# Altium schematic sheet Inv_filter_v1_SCH.SchDoc
size D
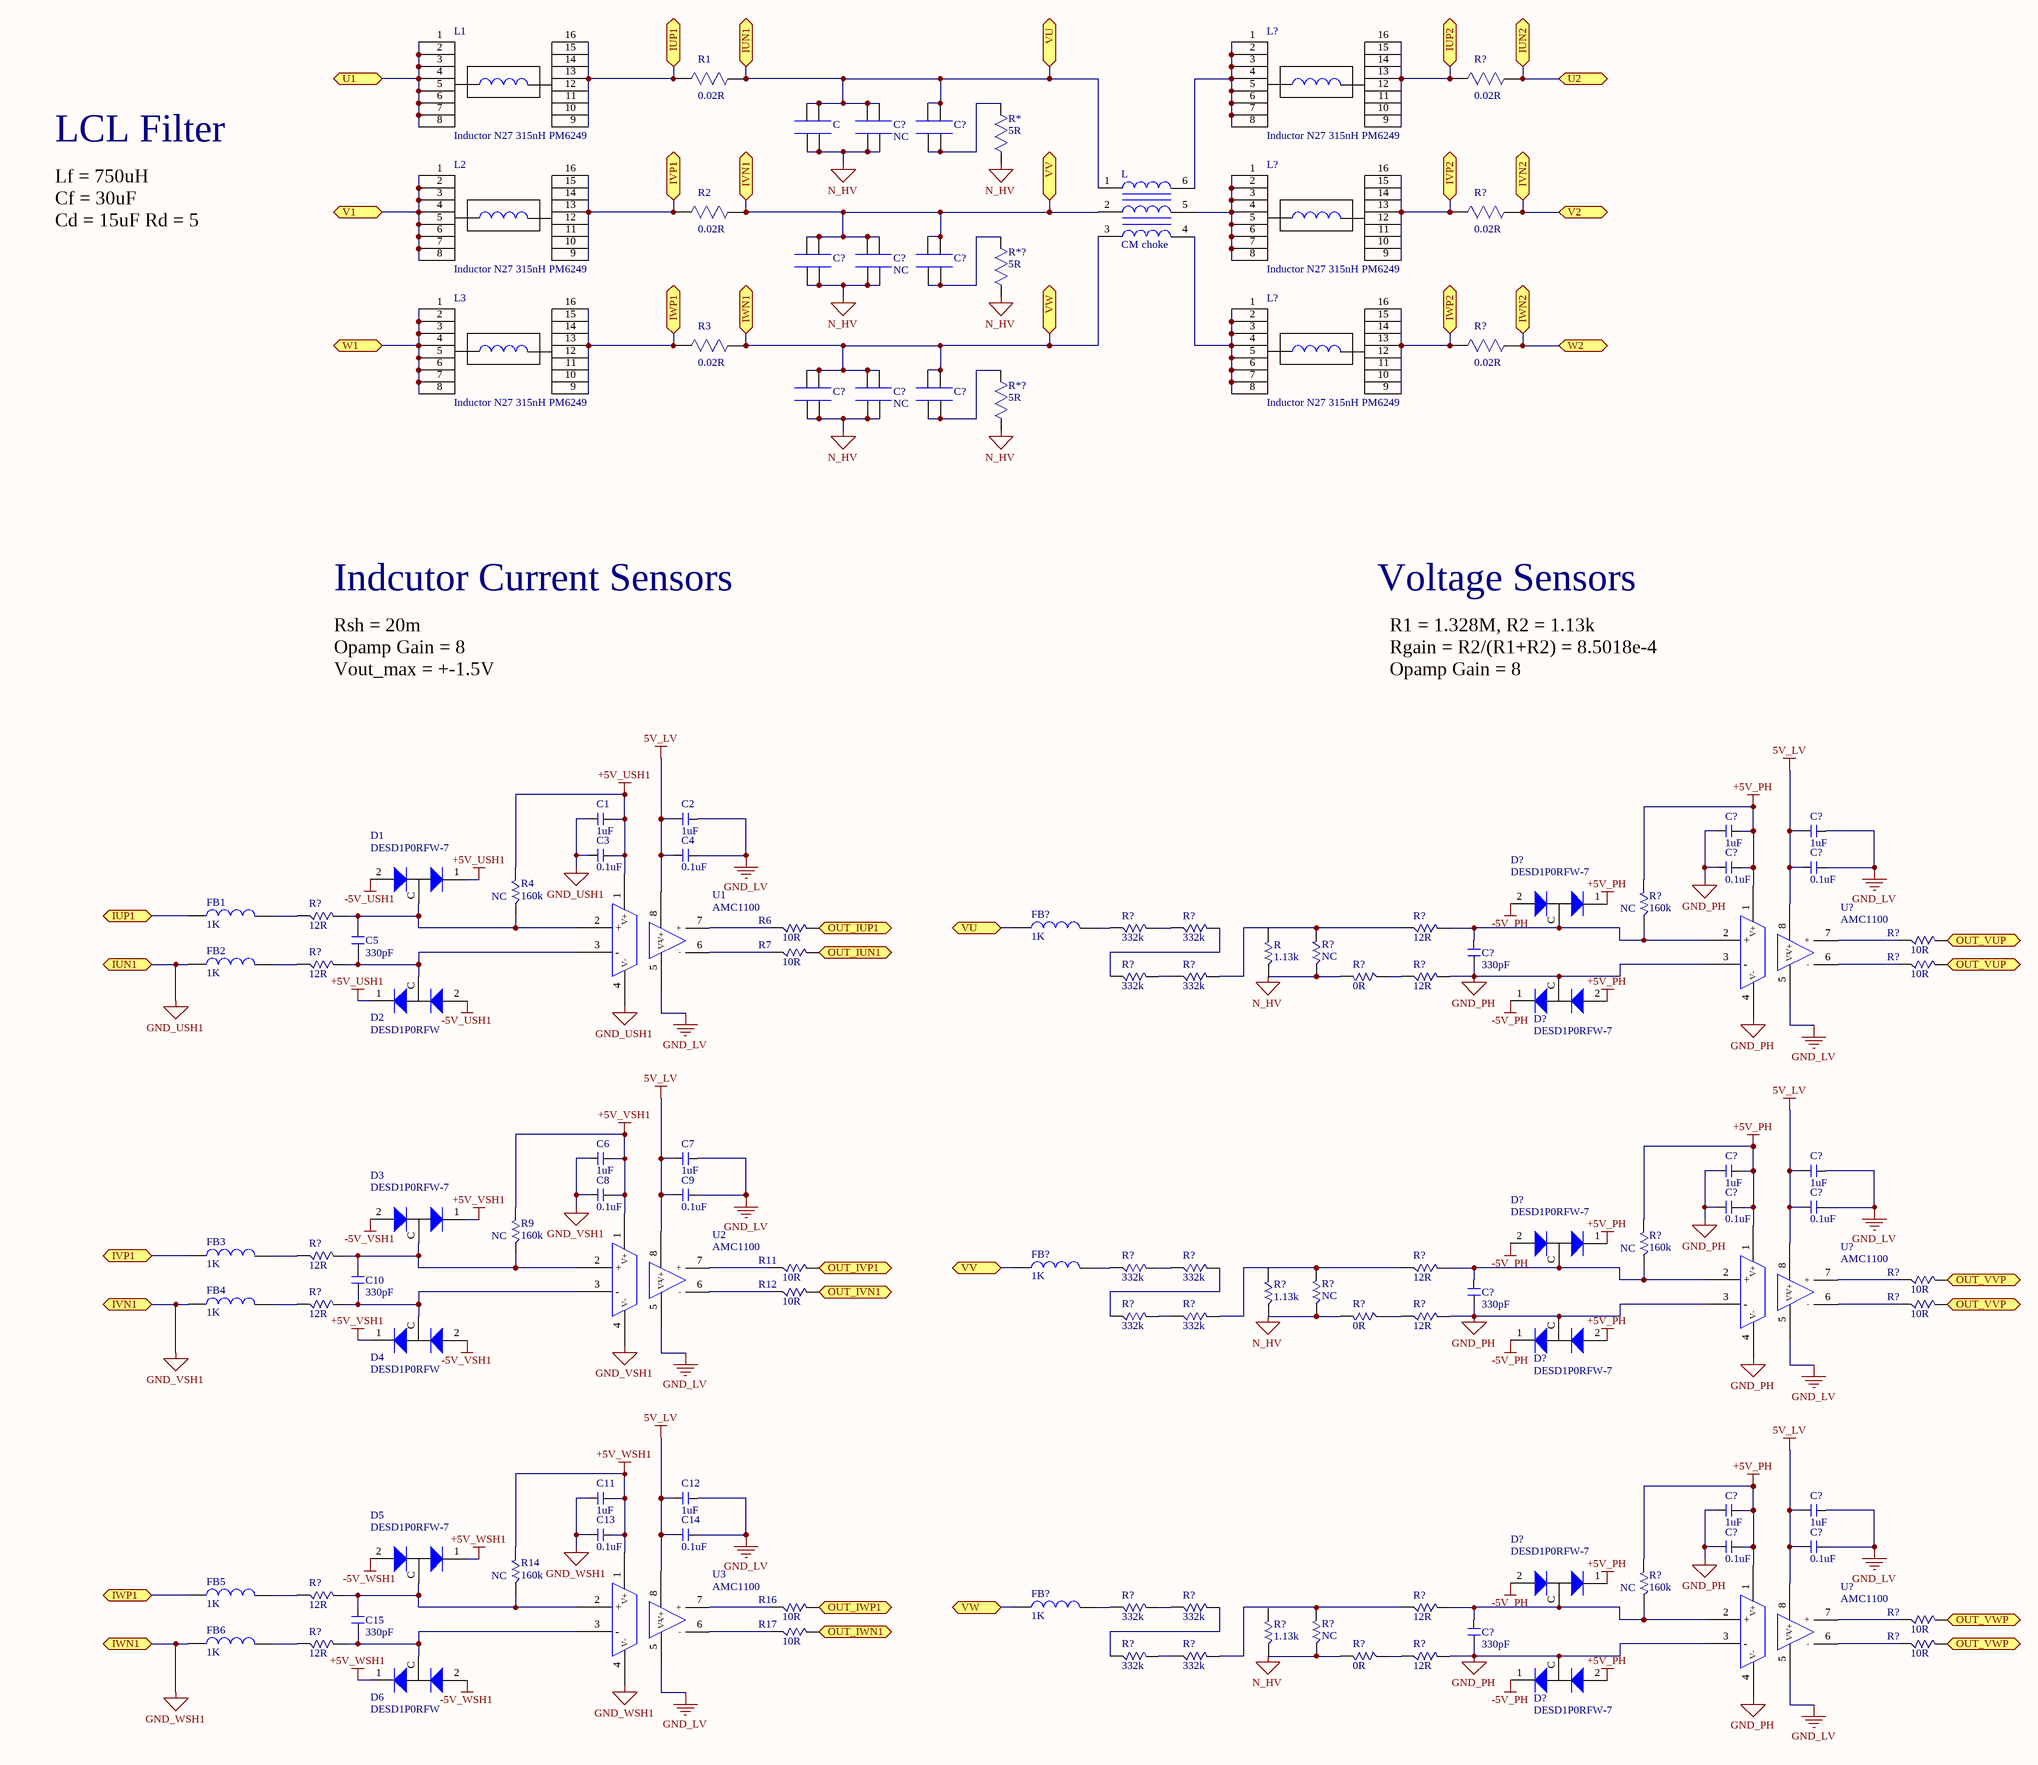
[diagram p0: Inv_filter_v1_SCH.SchDoc]

## Parts
(Parts that share a designator on the sheet are numbered #1, #2 ... from top to bottom, then left to right.)
C  Cap Film Radial - 4 Leads  [Radial - 4 Leads]  (value not drawn)
C1  value 1uF  [0603 (1608 Metric)]  (hidden comment: Cap 0603_new)
C2  value 1uF  [0603 (1608 Metric)]  (hidden comment: Cap 0603_new)
C3  value 0.1uF  [0603 (1608 Metric)]  (hidden comment: Cap 0603_new)
C4  value 0.1uF  [0603 (1608 Metric)]  (hidden comment: Cap 0603_new)
C5  value 330pF  [0603 (1608 Metric)]  (hidden comment: Cap 0603_new)
C6  value 1uF  [0603 (1608 Metric)]  (hidden comment: Cap 0603_new)
C7  value 1uF  [0603 (1608 Metric)]  (hidden comment: Cap 0603_new)
C8  value 0.1uF  [0603 (1608 Metric)]  (hidden comment: Cap 0603_new)
C9  value 0.1uF  [0603 (1608 Metric)]  (hidden comment: Cap 0603_new)
C10  value 330pF  [0603 (1608 Metric)]  (hidden comment: Cap 0603_new)
C11  value 1uF  [0603 (1608 Metric)]  (hidden comment: Cap 0603_new)
C12  value 1uF  [0603 (1608 Metric)]  (hidden comment: Cap 0603_new)
C13  value 0.1uF  [0603 (1608 Metric)]  (hidden comment: Cap 0603_new)
C14  value 0.1uF  [0603 (1608 Metric)]  (hidden comment: Cap 0603_new)
C15  value 330pF  [0603 (1608 Metric)]  (hidden comment: Cap 0603_new)
C?#1  value NC  [Radial - 4 Leads]  (hidden comment: Cap Film Radial - 4 Leads)
C?#2  Cap Film Radial - 4 Leads  [Radial - 4 Leads]  (value not drawn)
C?#3  Cap Film Radial - 4 Leads  [Radial - 4 Leads]  (value not drawn)
C?#4  value NC  [Radial - 4 Leads]  (hidden comment: Cap Film Radial - 4 Leads)
C?#5  Cap Film Radial - 4 Leads  [Radial - 4 Leads]  (value not drawn)
C?#6  Cap Film Radial - 4 Leads  [Radial - 4 Leads]  (value not drawn)
C?#7  value NC  [Radial - 4 Leads]  (hidden comment: Cap Film Radial - 4 Leads)
C?#8  Cap Film Radial - 4 Leads  [Radial - 4 Leads]  (value not drawn)
C?#9  value 1uF  [0603 (1608 Metric)]  (hidden comment: Cap 0603_new)
C?#10  value 1uF  [0603 (1608 Metric)]  (hidden comment: Cap 0603_new)
C?#11  value 0.1uF  [0603 (1608 Metric)]  (hidden comment: Cap 0603_new)
C?#12  value 0.1uF  [0603 (1608 Metric)]  (hidden comment: Cap 0603_new)
C?#13  value 330pF  [0603 (1608 Metric)]  (hidden comment: Cap 0603_new)
C?#14  value 1uF  [0603 (1608 Metric)]  (hidden comment: Cap 0603_new)
C?#15  value 1uF  [0603 (1608 Metric)]  (hidden comment: Cap 0603_new)
C?#16  value 0.1uF  [0603 (1608 Metric)]  (hidden comment: Cap 0603_new)
C?#17  value 0.1uF  [0603 (1608 Metric)]  (hidden comment: Cap 0603_new)
C?#18  value 330pF  [0603 (1608 Metric)]  (hidden comment: Cap 0603_new)
C?#19  value 1uF  [0603 (1608 Metric)]  (hidden comment: Cap 0603_new)
C?#20  value 1uF  [0603 (1608 Metric)]  (hidden comment: Cap 0603_new)
C?#21  value 0.1uF  [0603 (1608 Metric)]  (hidden comment: Cap 0603_new)
C?#22  value 0.1uF  [0603 (1608 Metric)]  (hidden comment: Cap 0603_new)
C?#23  value 330pF  [0603 (1608 Metric)]  (hidden comment: Cap 0603_new)
D1  Part: DESD1P0RFW-7  [SOT323_ESD]  (hidden comment: Diode_ESD)
D2  Part: DESD1P0RFW  [SOT323_ESD]  (hidden comment: Diode_ESD)
D3  Part: DESD1P0RFW-7  [SOT323_ESD]  (hidden comment: Diode_ESD)
D4  Part: DESD1P0RFW  [SOT323_ESD]  (hidden comment: Diode_ESD)
D5  Part: DESD1P0RFW-7  [SOT323_ESD]  (hidden comment: Diode_ESD)
D6  Part: DESD1P0RFW  [SOT323_ESD]  (hidden comment: Diode_ESD)
D?#1  Part: DESD1P0RFW-7  [SOT323_ESD]  (hidden comment: Diode_ESD)
D?#2  Part: DESD1P0RFW-7  [SOT323_ESD]  (hidden comment: Diode_ESD)
D?#3  Part: DESD1P0RFW-7  [SOT323_ESD]  (hidden comment: Diode_ESD)
D?#4  Part: DESD1P0RFW-7  [SOT323_ESD]  (hidden comment: Diode_ESD)
D?#5  Part: DESD1P0RFW-7  [SOT323_ESD]  (hidden comment: Diode_ESD)
D?#6  Part: DESD1P0RFW-7  [SOT323_ESD]  (hidden comment: Diode_ESD)
FB1  value 1K  [0603 (1608 Metric)]  (hidden comment: Ferrite bead)
FB2  value 1K  [0603 (1608 Metric)]  (hidden comment: Ferrite bead)
FB3  value 1K  [0603 (1608 Metric)]  (hidden comment: Ferrite bead)
FB4  value 1K  [0603 (1608 Metric)]  (hidden comment: Ferrite bead)
FB5  value 1K  [0603 (1608 Metric)]  (hidden comment: Ferrite bead)
FB6  value 1K  [0603 (1608 Metric)]  (hidden comment: Ferrite bead)
FB?#1  value 1K  [0603 (1608 Metric)]  (hidden comment: Ferrite bead)
FB?#2  value 1K  [0603 (1608 Metric)]  (hidden comment: Ferrite bead)
FB?#3  value 1K  [0603 (1608 Metric)]  (hidden comment: Ferrite bead)
L  CM choke  [CM Choke]
L1  Inductor N27 315nH PM6249  [IND_PM6249]
L2  Inductor N27 315nH PM6249  [IND_PM6249]
L3  Inductor N27 315nH PM6249  [IND_PM6249]
L?#1  Inductor N27 315nH PM6249  [IND_PM6249]
L?#2  Inductor N27 315nH PM6249  [IND_PM6249]
L?#3  Inductor N27 315nH PM6249  [IND_PM6249]
R  value 1.13k  [1206]  (hidden comment: Resistor 1206)
R1  value 0.02R  (hidden comment: Resistor Precision)
R2  value 0.02R  (hidden comment: Resistor Precision)
R3  value 0.02R  (hidden comment: Resistor Precision)
R4  NC  value 160k  [0603 (1608 Metric)]
R6  value 10R  [0603 (1608 Metric)]  (hidden comment: Resistor 0603)
R7  value 10R  [0603 (1608 Metric)]  (hidden comment: Resistor 0603)
R9  NC  value 160k  [0603 (1608 Metric)]
R11  value 10R  [0603 (1608 Metric)]  (hidden comment: Resistor 0603)
R12  value 10R  [0603 (1608 Metric)]  (hidden comment: Resistor 0603)
R14  NC  value 160k  [0603 (1608 Metric)]
R16  value 10R  [0603 (1608 Metric)]  (hidden comment: Resistor 0603)
R17  value 10R  [0603 (1608 Metric)]  (hidden comment: Resistor 0603)
R*  value 5R  [Axial 50mm]  (hidden comment: Resistor Power)
R*?#1  value 5R  [Axial 50mm]  (hidden comment: Resistor Power)
R*?#2  value 5R  [Axial 50mm]  (hidden comment: Resistor Power)
R?#1  value 0.02R  (hidden comment: Resistor Precision)
R?#2  value 0.02R  (hidden comment: Resistor Precision)
R?#3  value 0.02R  (hidden comment: Resistor Precision)
R?#4  value 12R  [1206]  (hidden comment: Resistor 1206)
R?#5  NC  value 160k  [0603 (1608 Metric)]
R?#6  value 332k  [1206]  (hidden comment: Resistor 1206)
R?#7  value 332k  [1206]  (hidden comment: Resistor 1206)
R?#8  value 12R  [1206]  (hidden comment: Resistor 1206)
R?#9  value 10R  [0603 (1608 Metric)]  (hidden comment: Resistor 0603)
R?#10  value 12R  [1206]  (hidden comment: Resistor 1206)
R?#11  value NC  [1206]  (hidden comment: Resistor 1206)
R?#12  value 10R  [0603 (1608 Metric)]  (hidden comment: Resistor 0603)
R?#13  value 332k  [1206]  (hidden comment: Resistor 1206)
R?#14  value 332k  [1206]  (hidden comment: Resistor 1206)
R?#15  value 0R  [0603 (1608 Metric)]  (hidden comment: Resistor 0603)
R?#16  value 12R  [1206]  (hidden comment: Resistor 1206)
R?#17  value 12R  [1206]  (hidden comment: Resistor 1206)
R?#18  NC  value 160k  [0603 (1608 Metric)]
R?#19  value 332k  [1206]  (hidden comment: Resistor 1206)
R?#20  value 332k  [1206]  (hidden comment: Resistor 1206)
R?#21  value 12R  [1206]  (hidden comment: Resistor 1206)
R?#22  value 10R  [0603 (1608 Metric)]  (hidden comment: Resistor 0603)
R?#23  value 12R  [1206]  (hidden comment: Resistor 1206)
R?#24  value 1.13k  [1206]  (hidden comment: Resistor 1206)
R?#25  value NC  [1206]  (hidden comment: Resistor 1206)
R?#26  value 10R  [0603 (1608 Metric)]  (hidden comment: Resistor 0603)
R?#27  value 332k  [1206]  (hidden comment: Resistor 1206)
R?#28  value 332k  [1206]  (hidden comment: Resistor 1206)
R?#29  value 0R  [0603 (1608 Metric)]  (hidden comment: Resistor 0603)
R?#30  value 12R  [1206]  (hidden comment: Resistor 1206)
R?#31  value 12R  [1206]  (hidden comment: Resistor 1206)
R?#32  NC  value 160k  [0603 (1608 Metric)]
R?#33  value 332k  [1206]  (hidden comment: Resistor 1206)
R?#34  value 332k  [1206]  (hidden comment: Resistor 1206)
R?#35  value 12R  [1206]  (hidden comment: Resistor 1206)
R?#36  value 10R  [0603 (1608 Metric)]  (hidden comment: Resistor 0603)
R?#37  value 12R  [1206]  (hidden comment: Resistor 1206)
R?#38  value 1.13k  [1206]  (hidden comment: Resistor 1206)
R?#39  value NC  [1206]  (hidden comment: Resistor 1206)
R?#40  value 10R  [0603 (1608 Metric)]  (hidden comment: Resistor 0603)
R?#41  value 332k  [1206]  (hidden comment: Resistor 1206)
R?#42  value 332k  [1206]  (hidden comment: Resistor 1206)
R?#43  value 0R  [0603 (1608 Metric)]  (hidden comment: Resistor 0603)
R?#44  value 12R  [1206]  (hidden comment: Resistor 1206)
U1  AMC1100  [SOP8]
U2  AMC1100  [SOP8]
U3  AMC1100  [SOP8]
U?#1  AMC1100  [SOP8]
U?#2  AMC1100  [SOP8]
U?#3  AMC1100  [SOP8]

## Ports
IUN1, IUN2, IUP1, IUP2, IVN1, IVN2, IVP1, IVP2, IWN1, IWN2, IWP1, IWP2, OUT_IUN1, OUT_IUP1, OUT_IVN1, OUT_IVP1, OUT_IWN1, OUT_IWP1, OUT_VUP, OUT_VVP, OUT_VWP, U1, U2, V1, V2, VU, VV, VW, W1, W2

## Nets
5V_LV: C2.1(OUT) C4.1(OUT) C7.1(OUT) C9.1(OUT) C12.1(OUT) C14.1(OUT) C?#10.1(OUT) C?#12.1(OUT) C?#15.1(OUT) C?#17.1(OUT) C?#20.1(OUT) C?#22.1(OUT) U1.8(V+) U2.8(V+) U3.8(V+) U?#1.8(V+) U?#2.8(V+) U?#3.8(V+)
+5V_PH: C?#9.2(OUT) C?#11.2(OUT) C?#14.2(OUT) C?#16.2(OUT) C?#19.2(OUT) C?#21.2(OUT) D?#1.1(Anode) D?#2.2(Anode) D?#3.1(Anode) D?#4.2(Anode) D?#5.1(Anode) D?#6.2(Anode) R?#5.2(A) R?#18.2(A) R?#32.2(A) U?#1.1(V+) U?#2.1(V+) U?#3.1(V+)
+5V_USH1: C1.2(OUT) C3.2(OUT) D1.1(Anode) D2.1(Anode) R4.2(A) U1.1(V+)
+5V_VSH1: C6.2(OUT) C8.2(OUT) D3.1(Anode) D4.1(Anode) R9.2(A) U2.1(V+)
+5V_WSH1: C11.2(OUT) C13.2(OUT) D5.1(Anode) D6.1(Anode) R14.2(A) U3.1(V+)
-5V_PH: D?#1.2(Anode) D?#2.1(Anode) D?#3.2(Anode) D?#4.1(Anode) D?#5.2(Anode) D?#6.1(Anode)
-5V_USH1: D1.2(Anode) D2.2(Anode)
-5V_VSH1: D3.2(Anode) D4.2(Anode)
-5V_WSH1: D5.2(Anode) D6.2(Anode)
GND_LV: C2.2(OUT) C4.2(OUT) C7.2(OUT) C9.2(OUT) C12.2(OUT) C14.2(OUT) C?#10.2(OUT) C?#12.2(OUT) C?#15.2(OUT) C?#17.2(OUT) C?#20.2(OUT) C?#22.2(OUT) U1.5(V-) U2.5(V-) U3.5(V-) U?#1.5(V-) U?#2.5(V-) U?#3.5(V-)
GND_PH: C?#9.1(OUT) C?#11.1(OUT) C?#13.2(OUT) C?#14.1(OUT) C?#16.1(OUT) C?#18.2(OUT) C?#19.1(OUT) C?#21.1(OUT) C?#23.2(OUT) D?#2.C(Cathode) D?#4.C(Cathode) D?#6.C(Cathode) R?#16.2(A) R?#30.2(A) R?#44.2(A) U?#1.3(-) U?#1.4(V-) U?#2.3(-) U?#2.4(V-) U?#3.3(-) U?#3.4(V-)
GND_USH1: C.4(OUT) C1.1(OUT) C3.1(OUT) C?#1.4(OUT) C?#2.4(OUT) FB2.1(OUT) FB?#1.1(OUT) L.1 R1.2 U1.4(V-) ; port IUN1, port VU
GND_VSH1: C6.1(OUT) C8.1(OUT) C?#3.4(OUT) C?#4.4(OUT) C?#5.4(OUT) FB4.1(OUT) FB?#2.1(OUT) L.2 R2.2 U2.4(V-) ; port IVN1, port VV
GND_WSH1: C11.1(OUT) C13.1(OUT) C?#6.4(OUT) C?#7.4(OUT) C?#8.4(OUT) FB6.1(OUT) FB?#3.1(OUT) L.3 R3.2 U3.4(V-) ; port IWN1, port VW
N_HV: C.1(OUT) C.2(OUT) C?#1.1(OUT) C?#1.2(OUT) C?#3.1(OUT) C?#3.2(OUT) C?#4.1(OUT) C?#4.2(OUT) C?#6.1(OUT) C?#6.2(OUT) C?#7.1(OUT) C?#7.2(OUT) R*.1 R*?#1.1 R*?#2.1 R?#11.1(A) R?#15.2(A) R?#25.1(A) R?#29.2(A) R?#39.1(A) R?#43.2(A)
IUN2: R?#1.2 ; port U2, port IUN2
IUP1: FB1.1(OUT) R1.1 ; port IUP1
IUP2: R?#1.1 ; port IUP2
IVN2: R?#2.2 ; port V2, port IVN2
IVP1: FB3.1(OUT) R2.1 ; port IVP1
IVP2: R?#2.1 ; port IVP2
IWN2: R?#3.2 ; port W2, port IWN2
IWP1: FB5.1(OUT) R3.1 ; port IWP1
IWP2: R?#3.1 ; port IWP2
OUT_IUN1: R7.2(A) ; port OUT_IUN1
OUT_IUP1: R6.2(A) ; port OUT_IUP1
OUT_IVN1: R12.2(A) ; port OUT_IVN1
OUT_IVP1: R11.2(A) ; port OUT_IVP1
OUT_IWN1: R17.2(A) ; port OUT_IWN1
OUT_IWP1: R16.2(A) ; port OUT_IWP1
OUT_VUP: R?#9.2(A) R?#12.2(A) ; port OUT_VUP
OUT_VVP: R?#22.2(A) R?#26.2(A) ; port OUT_VVP
OUT_VWP: R?#36.2(A) R?#40.2(A) ; port OUT_VWP
U1: L1.1 L1.2 L1.3 L1.4 L1.5 L1.6 L1.7 L1.8 ; port U1
V1: L2.1 L2.2 L2.3 L2.4 L2.5 L2.6 L2.7 L2.8 ; port V1
W1: L3.1 L3.2 L3.3 L3.4 L3.5 L3.6 L3.7 L3.8 ; port W1
NetC5_1: C5.1(OUT) D1.C(Cathode) R4.1(A) R?#4.2(A) U1.2(+)
NetC5_2: C5.2(OUT) D2.C(Cathode) R?#10.2(A) U1.3(-)
NetC10_1: C10.1(OUT) D3.C(Cathode) R9.1(A) R?#17.2(A) U2.2(+)
NetC10_2: C10.2(OUT) D4.C(Cathode) R?#23.2(A) U2.3(-)
NetC15_1: C15.1(OUT) D5.C(Cathode) R14.1(A) R?#31.2(A) U3.2(+)
NetC15_2: C15.2(OUT) D6.C(Cathode) R?#37.2(A) U3.3(-)
NetC?#2_1: C?#2.1(OUT) C?#2.2(OUT) R*.2
NetC?#5_1: C?#5.1(OUT) C?#5.2(OUT) R*?#1.2
NetC?#8_1: C?#8.1(OUT) C?#8.2(OUT) R*?#2.2
NetC?#13_1: C?#13.1(OUT) D?#1.C(Cathode) R?#5.1(A) R?#8.2(A) U?#1.2(+)
NetC?#18_1: C?#18.1(OUT) D?#3.C(Cathode) R?#18.1(A) R?#21.2(A) U?#2.2(+)
NetC?#23_1: C?#23.1(OUT) D?#5.C(Cathode) R?#32.1(A) R?#35.2(A) U?#3.2(+)
NetFB1_2: FB1.2(OUT) R?#4.1(A)
NetFB2_2: FB2.2(OUT) R?#10.1(A)
NetFB3_2: FB3.2(OUT) R?#17.1(A)
NetFB4_2: FB4.2(OUT) R?#23.1(A)
NetFB5_2: FB5.2(OUT) R?#31.1(A)
NetFB6_2: FB6.2(OUT) R?#37.1(A)
NetFB?#1_2: FB?#1.2(OUT) R?#6.1(A)
NetFB?#2_2: FB?#2.2(OUT) R?#19.1(A)
NetFB?#3_2: FB?#3.2(OUT) R?#33.1(A)
NetL_4: L.4 L?#3.1 L?#3.2 L?#3.3 L?#3.4 L?#3.5 L?#3.6 L?#3.7 L?#3.8
NetL_5: L.5 L?#2.1 L?#2.2 L?#2.3 L?#2.4 L?#2.5 L?#2.6 L?#2.7 L?#2.8
NetL_6: L.6 L?#1.1 L?#1.2 L?#1.3 L?#1.4 L?#1.5 L?#1.6 L?#1.7 L?#1.8
NetR6_1: R6.1(A) U1.7(+)
NetR7_1: R7.1(A) U1.6(-)
NetR11_1: R11.1(A) U2.7(+)
NetR12_1: R12.1(A) U2.6(-)
NetR16_1: R16.1(A) U3.7(+)
NetR17_1: R17.1(A) U3.6(-)
NetR?#6_2: R?#6.2(A) R?#7.1(A)
NetR?#7_2: R?#7.2(A) R?#13.1(A)
NetR?#8_1: R?#8.1(A) R?#11.2(A) R?#14.2(A)
NetR?#9_1: R?#9.1(A) U?#1.7(+)
NetR?#12_1: R?#12.1(A) U?#1.6(-)
NetR?#13_2: R?#13.2(A) R?#14.1(A)
NetR?#15_1: R?#15.1(A) R?#16.1(A)
NetR?#19_2: R?#19.2(A) R?#20.1(A)
NetR?#20_2: R?#20.2(A) R?#27.1(A)
NetR?#21_1: R?#21.1(A) R?#25.2(A) R?#28.2(A)
NetR?#22_1: R?#22.1(A) U?#2.7(+)
NetR?#26_1: R?#26.1(A) U?#2.6(-)
NetR?#27_2: R?#27.2(A) R?#28.1(A)
NetR?#29_1: R?#29.1(A) R?#30.1(A)
NetR?#33_2: R?#33.2(A) R?#34.1(A)
NetR?#34_2: R?#34.2(A) R?#41.1(A)
NetR?#35_1: R?#35.1(A) R?#39.2(A) R?#42.2(A)
NetR?#36_1: R?#36.1(A) U?#3.7(+)
NetR?#40_1: R?#40.1(A) U?#3.6(-)
NetR?#41_2: R?#41.2(A) R?#42.1(A)
NetR?#43_1: R?#43.1(A) R?#44.1(A)

Not connected (* = marked no-connect by the designer): L1 9(8) 10(8) 11(8) 12(8) 13(8) 14(8) 15(8) 16(8); L2 9(8) 10(8) 11(8) 12(8) 13(8) 14(8) 15(8) 16(8); L3 9(8) 10(8) 11(8) 12(8) 13(8) 14(8) 15(8) 16(8); L?#1 9(8) 10(8) 11(8) 12(8) 13(8) 14(8) 15(8) 16(8); L?#2 9(8) 10(8) 11(8) 12(8) 13(8) 14(8) 15(8) 16(8); L?#3 9(8) 10(8) 11(8) 12(8) 13(8) 14(8) 15(8) 16(8); R 1(A) 2(A); R?#24 1(A) 2(A); R?#38 1(A) 2(A)

## Notes on the sheet
- LCL Filter
- Lf = 750uH
  Cf = 30uF
  Cd = 15uF Rd = 5
  Lm = 300uH
- Indcutor Current Sensors
- Voltage Sensors
- Rsh = 20m
  Opamp Gain = 8
  Vout_max = +-1.5V
  Maximum current = +- 9.375A
- R1 = 1.328M, R2 = 1.13k
  Rgain = R2/(R1+R2) = 8.5018e-4
  Opamp Gain = 8
  Vmax = 220.5415V

## Library data of the parts
C C?#1-C?#8 = Cap Film Radial - 4 Leads: Radial - 4 Leads; Part: *
C1 C2 C6 C7 C11 C12 C?#9 C?#10 C?#14 C?#15 C?#19 C?#20 = Cap 0603_new: CAP CER 1UF 50V X5R 0603; part: 1276-1860-1-ND
C3 C4 C8 C9 C13 C14 C?#11 C?#12 C?#16 C?#17 C?#21 C?#22 = Cap 0603_new: CAP CER 0.1UF 50V Y5V 0603; part: 311-1343-6-ND
C5 C10 C15 C?#13 C?#18 C?#23 = Cap 0603_new: CAP CER 330PF 50V C0G 0603; part: 445-7033-2-ND
D1-D6 D?#1-D?#6 = Diode_ESD: Value: ESD
FB1-FB6 FB?#1-FB?#3 = Ferrite bead: FERRITE BEAD 1 KOHM 0603 1LN; Part: 445-8672-1-ND
L = CMC 1.5MH 20A: CMC 1.5MH 20A 3LN TH; Part: B82747E6203A40
R R?#24 R?#38 = Resistor 1206: RES SMD 1.13K OHM 0.1% 1/4W 1206; Part: P1.13KBCCT-ND
R4 R9 R14 R?#5 R?#18 R?#32 = Resistor 0603
R6 R7 R11 R12 R16 R17 R?#9 R?#12 R?#22 R?#26 R?#36 R?#40 = Resistor 0603: RES SMD 10 OHM 0.05% 1/10W 0603; Part: RNCF0603AKT10R0CT-ND
R* R*?#1 R*?#2 = Resistor Power: RES 5.0 OHM 10W 1% WW AXIAL; Part: RSD-5.0RCT-ND
R?#4 R?#8 R?#10 R?#16 R?#17 R?#21 R?#23 R?#30 R?#31 R?#35 R?#37 R?#44 = Resistor 1206: 12 Ohm ±0.5% 0.25W, 1/4W Chip Resistor 1206; Part: 311-2961-1-ND
R?#6 R?#7 R?#13 R?#14 R?#19 R?#20 R?#27 R?#28 R?#33 R?#34 R?#41 R?#42 = Resistor 1206: RES SMD 332K OHM 0.1% 1/4W 1206; Part: RG32P332KBCT-ND